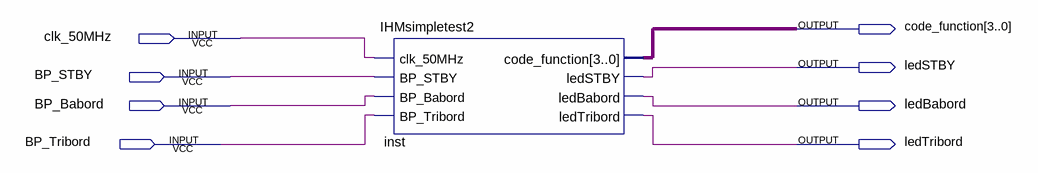
[diagram p0: schematic sheet]
// Quartus schematic IHMsimple.bdf as structural Verilog: 1 symbols, 8 pins
module IHMsimple (
  input  clk_50MHz,
  input  BP_STBY,
  input  BP_Babord,
  input  BP_Tribord,
  output [3:0] code_function,
  output ledSTBY,
  output ledBabord,
  output ledTribord
);

  IHMsimpletest2 inst (
    .clk_50MHz(clk_50MHz), .BP_STBY(BP_STBY), .BP_Babord(BP_Babord), .BP_Tribord(BP_Tribord),
    .code_function(code_function), .ledSTBY(ledSTBY), .ledBabord(ledBabord), .ledTribord(ledTribord));
endmodule
